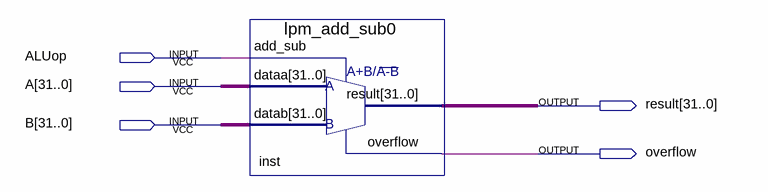
[diagram p0: schematic sheet]
// Quartus schematic ALU.bdf as structural Verilog: 1 symbols, 5 pins
module ALU (
  input  ALUop,
  input  [31:0] A,
  input  [31:0] B,
  output [31:0] result,
  output overflow
);

  lpm_add_sub0 inst (.add_sub(ALUop), .dataa(A), .datab(B), .result(result), .overflow(overflow));
endmodule
